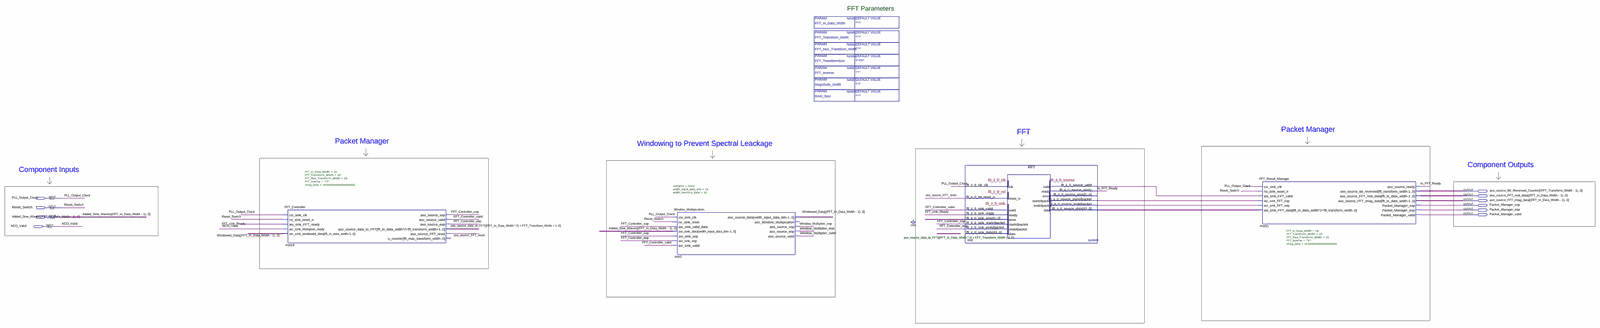
[diagram p0: schematic sheet, whole]
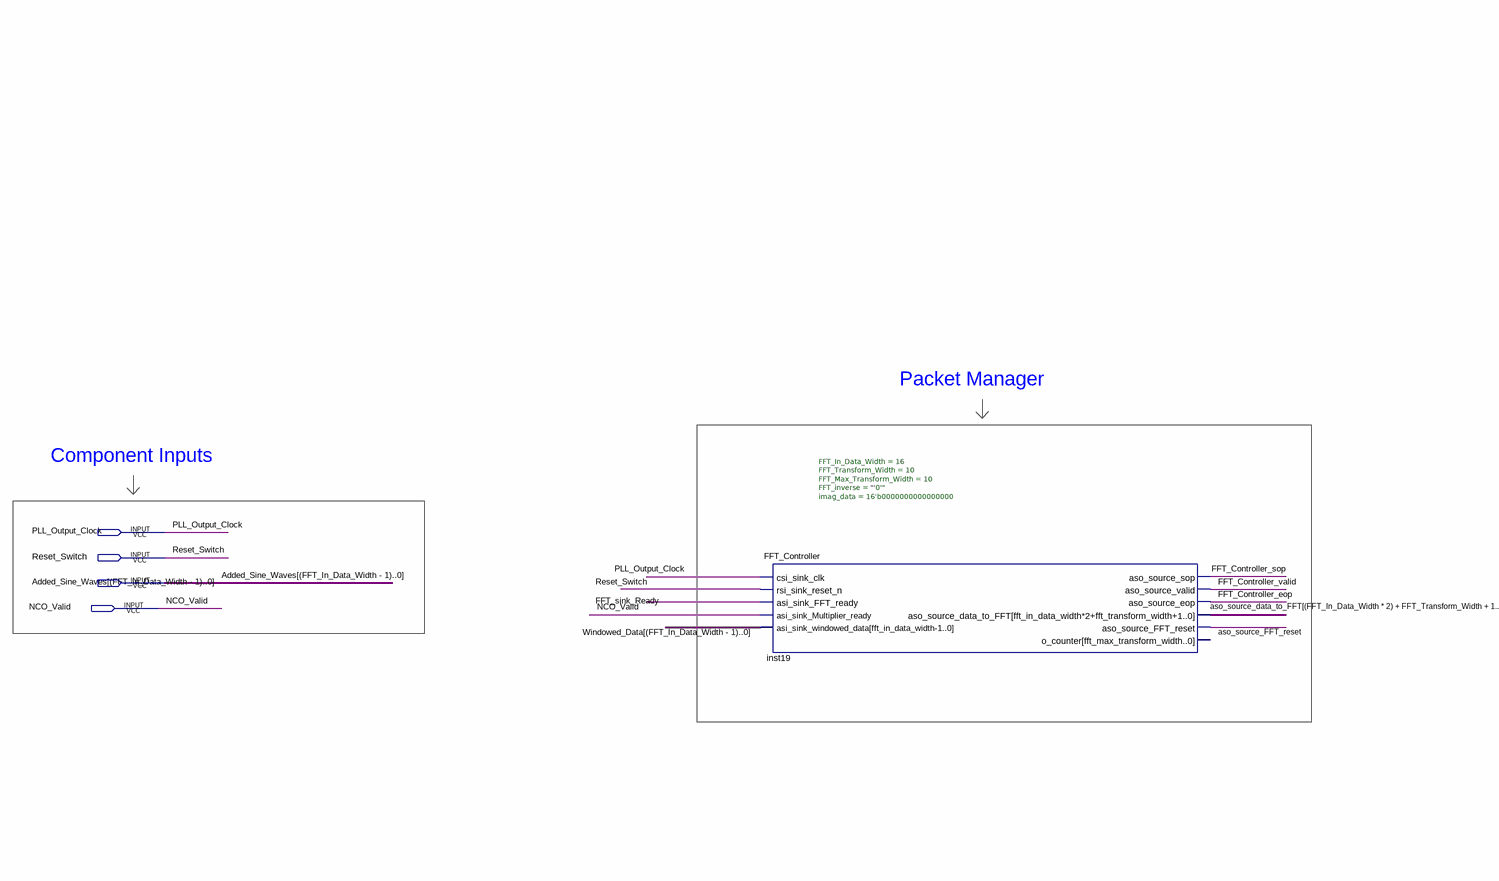
[diagram p1: schematic sheet, left part]
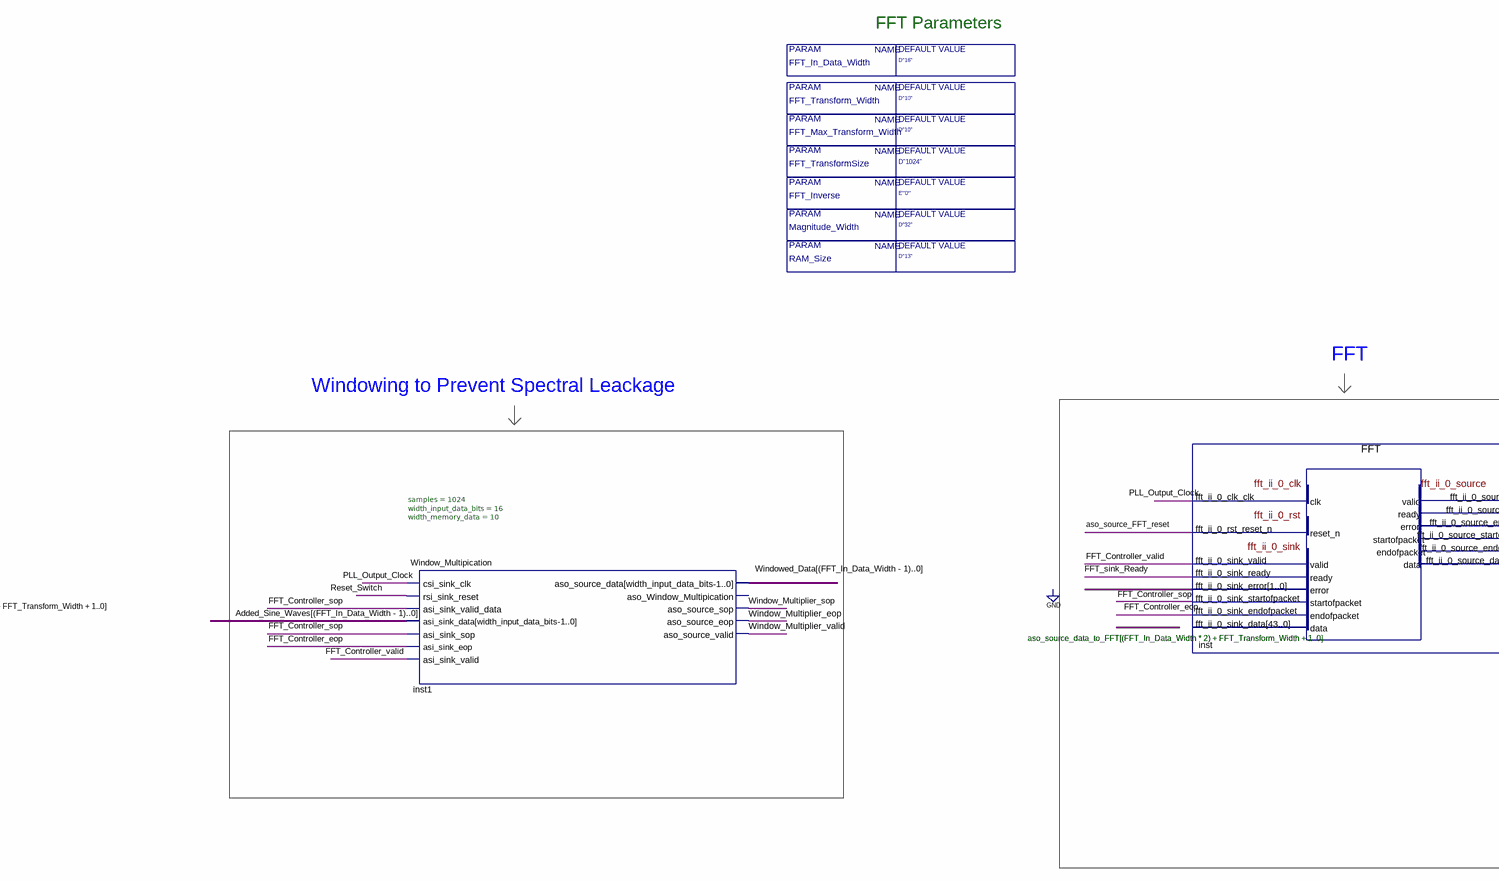
[diagram p2: schematic sheet, centre part]
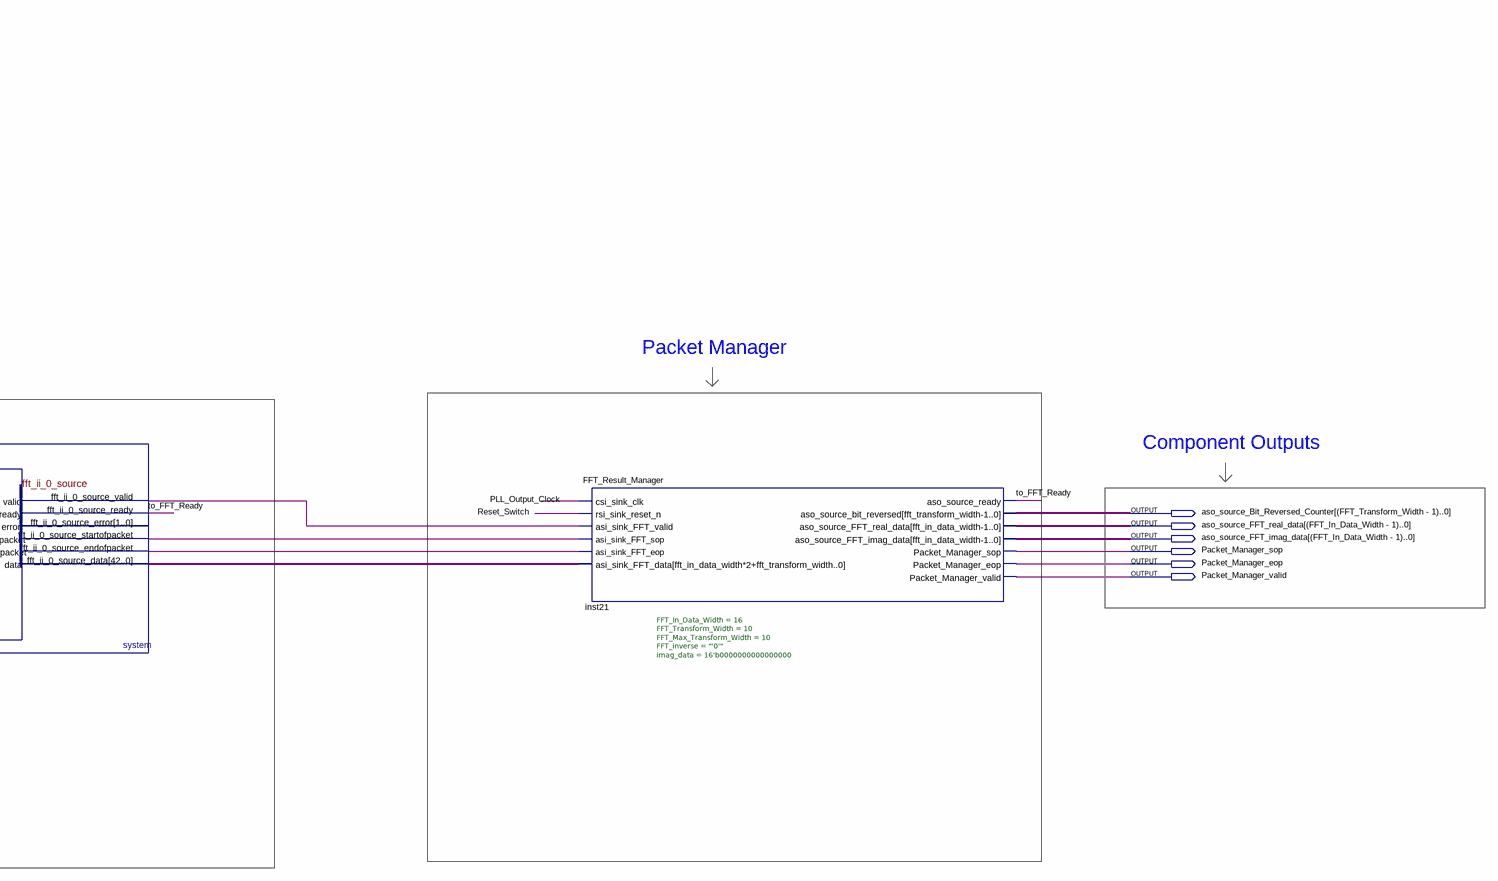
[diagram p3: schematic sheet, right part]
// Quartus schematic Packeted_FFT_Component.bdf as structural Verilog: 4 symbols, 10 pins
module Packeted_FFT_Component #(parameter FFT_Inverse = "E\"'0'\"", parameter FFT_In_Data_Width = "D\"16\"", parameter RAM_Size = "D\"13\"", parameter Magnitude_Width = "D\"32\"", parameter FFT_TransformSize = "D\"1024\"", parameter FFT_Max_Transform_Width = "D\"10\"", parameter FFT_Transform_Width = "D\"10\"") (
  input  PLL_Output_Clock,
  input  Reset_Switch,
  input  \Added_Sine_Waves[(FFT_In_Data_Width_-_1)..0] ,
  input  NCO_Valid,
  output \aso_source_Bit_Reversed_Counter[(FFT_Transform_Width_-_1)..0] ,
  output \aso_source_FFT_real_data[(FFT_In_Data_Width_-_1)..0] ,
  output \aso_source_FFT_imag_data[(FFT_In_Data_Width_-_1)..0] ,
  output Packet_Manager_sop,
  output Packet_Manager_eop,
  output Packet_Manager_valid
);

  wire \aso_source_data_to_FFT[(FFT_In_Data_Width_*_2)_+_FFT_Transform_Width_+_1..0] , aso_source_FFT_reset,
       FFT_Controller_eop, FFT_Controller_sop, FFT_Controller_valid, FFT_sink_Ready,
       inst_fft_ii_0_source_endofpacket, inst_fft_ii_0_source_startofpacket, inst_fft_ii_0_source_valid,
       to_FFT_Ready, Window_Multiplier_eop, Window_Multiplier_sop, Window_Multiplier_valid,
       \Windowed_Data[(FFT_In_Data_Width_-_1)..0] ;
  wire [1:0] undriven;
  wire [9:0] inst21_aso_source_bit_reversed;
  wire [15:0] inst21_aso_source_fft_imag_data, inst21_aso_source_fft_real_data;
  wire [42:0] inst_fft_ii_0_source_data;

  FFT_Controller #(.FFT_In_Data_Width(16), .FFT_Transform_Width(10), .FFT_Max_Transform_Width(10), .FFT_inverse("'0'"), .imag_data(16'b0000000000000000)) inst19 (
    .csi_sink_clk(PLL_Output_Clock), .rsi_sink_reset_n(Reset_Switch), .asi_sink_FFT_ready(FFT_sink_Ready),
    .asi_sink_Multiplier_ready(NCO_Valid),
    .asi_sink_windowed_data({16{\Windowed_Data[(FFT_In_Data_Width_-_1)..0] }}),
    .aso_source_sop(FFT_Controller_sop), .aso_source_valid(FFT_Controller_valid),
    .aso_source_eop(FFT_Controller_eop),
    .aso_source_data_to_FFT(\aso_source_data_to_FFT[(FFT_In_Data_Width_*_2)_+_FFT_Transform_Width_+_1..0] ),
    .aso_source_FFT_reset(aso_source_FFT_reset));  // open: o_counter
  Window_Multipication #(.samples(1024), .width_input_data_bits(16), .width_memory_data(10)) inst1 (
    .csi_sink_clk(PLL_Output_Clock), .rsi_sink_reset(Reset_Switch), .asi_sink_valid_data(FFT_Controller_sop),
    .asi_sink_data({16{\Added_Sine_Waves[(FFT_In_Data_Width_-_1)..0] }}), .asi_sink_sop(FFT_Controller_sop),
    .asi_sink_eop(FFT_Controller_eop), .asi_sink_valid(FFT_Controller_valid),
    .aso_source_data(\Windowed_Data[(FFT_In_Data_Width_-_1)..0] ), .aso_source_sop(Window_Multiplier_sop),
    .aso_source_eop(Window_Multiplier_eop), .aso_source_valid(Window_Multiplier_valid));  // open: aso_Window_Multipication
  FFT inst (
    .fft_ii_0_clk_clk(PLL_Output_Clock), .fft_ii_0_rst_reset_n(aso_source_FFT_reset),
    .fft_ii_0_sink_valid(FFT_Controller_valid), .fft_ii_0_sink_error(undriven),
    .fft_ii_0_sink_startofpacket(FFT_Controller_sop), .fft_ii_0_sink_endofpacket(FFT_Controller_eop),
    .fft_ii_0_source_ready(to_FFT_Ready), .fft_ii_0_sink_ready(FFT_sink_Ready),
    .fft_ii_0_source_valid(inst_fft_ii_0_source_valid),
    .fft_ii_0_source_startofpacket(inst_fft_ii_0_source_startofpacket),
    .fft_ii_0_source_endofpacket(inst_fft_ii_0_source_endofpacket),
    .fft_ii_0_source_data(inst_fft_ii_0_source_data));  // open: fft_ii_0_sink_data, fft_ii_0_source_error
  FFT_Result_Manager #(.FFT_In_Data_Width(16), .FFT_Transform_Width(10), .FFT_Max_Transform_Width(10), .FFT_inverse("'0'"), .imag_data(16'b0000000000000000)) inst21 (
    .csi_sink_clk(PLL_Output_Clock), .rsi_sink_reset_n(Reset_Switch),
    .asi_sink_FFT_valid(inst_fft_ii_0_source_valid), .asi_sink_FFT_sop(inst_fft_ii_0_source_startofpacket),
    .asi_sink_FFT_eop(inst_fft_ii_0_source_endofpacket), .asi_sink_FFT_data(inst_fft_ii_0_source_data),
    .aso_source_ready(to_FFT_Ready), .aso_source_bit_reversed(inst21_aso_source_bit_reversed),
    .aso_source_FFT_real_data(inst21_aso_source_fft_real_data),
    .aso_source_FFT_imag_data(inst21_aso_source_fft_imag_data), .Packet_Manager_sop(Packet_Manager_sop),
    .Packet_Manager_eop(Packet_Manager_eop), .Packet_Manager_valid(Packet_Manager_valid));

  // Notes on the sheet:
  //   FFT Parameters
  //   Packet Manager  
  //   FFT
  //   Packet Manager  
  //   Windowing to Prevent Spectral Leackage     
  //   Component Outputs   
  //   Component Inputs   
  //   aso_source_data_to_FFT[(FFT_In_Data_Width * 2) + FFT_Transform_Width + 1..0]
endmodule
